# Altium schematic sheet Power.SchDoc
size A
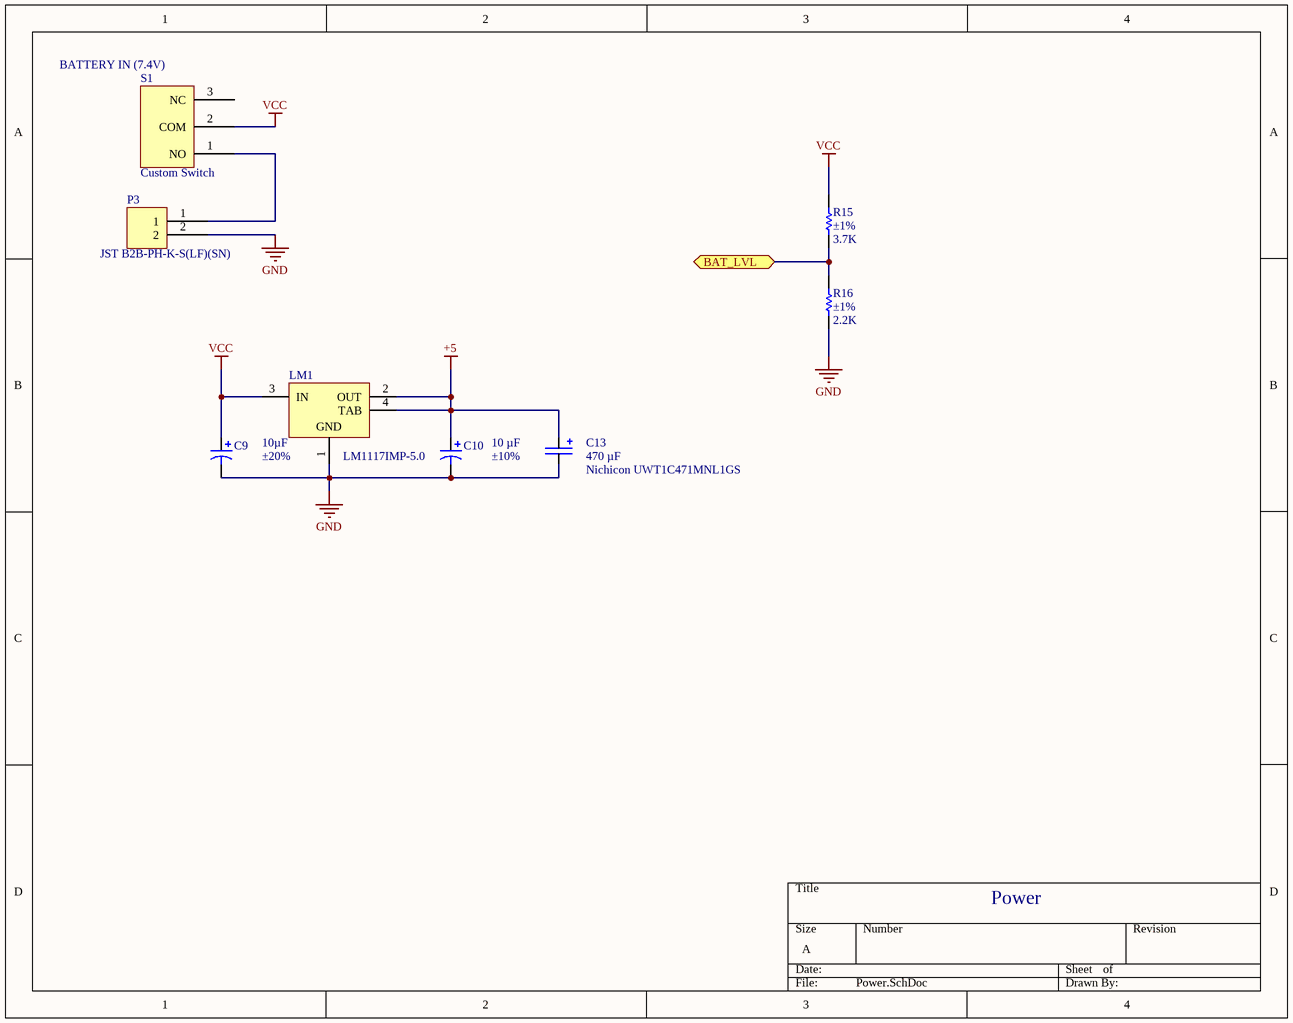
[diagram p0: Power.SchDoc]

## Parts
C9  Capacitance: 10µF  Capacitance Tolerance: ±20%  [PCB-220579-1]  (hidden comment: Kemet T491A106M006AT)
C10  Capacitance: 10 µF  Capacitance Tolerance: ±10%  [CASE B]  (hidden comment: Kemet T491B476K010AT)
C13  Nichicon UWT1C471MNL1GS  Capacitance: 470 µF  [PCB-ohlypd69c1s53jj2mkj6-1]
LM1  LM1117IMP-5.0  [MP04A_L]
P3  JST B2B-PH-K-S(LF)(SN)  [PCB-gpdi66yn1jko56crxrq7-1]
R15  Resistance Tolerance: ±1%  Resistance: 3.7K  [PCB-4097432-1]  (hidden comment: Bourns CR0805-FX-4701GLF)
R16  Resistance Tolerance: ±1%  Resistance: 2.2K  [PCB-4097432-1]  (hidden comment: Bourns CR0805-FX-4701GLF)
S1  Custom Switch  [PCB-tnt45azynpcpxvd4cmrw-1]

## Ports
BAT_LVL (bidir)

## Nets
+5: C10.1 C13.P(+) LM1.2(OUT) LM1.4(TAB)
GND: C9.2 C10.2 C13.M(-) LM1.1(GND) P3.2 R16.1
VCC: C9.1 LM1.3(IN) R15.2 S1.2(COM)
BAT_LVL: R15.1 R16.2 ; port BAT_LVL
NetP3_1: P3.1 S1.1(NO)

Not connected (* = marked no-connect by the designer): S1 3(NC)

## Notes on the sheet
- (near S1) BATTERY IN (7.4V)
- Power

## Library data of the parts
C9 = CMP-220579-2: CAP TANT 10UF 6.3V 20% 1206; Case/Package (SI): 3216-18; Equivalent Series Resistance (ESR): 4.0 Ω; Lead-Free Status: Lead Free; Voltage Rating (DC): 6.0 V; Case/Package: 3216-18; Mounting Style: Surface Mount; Number of Pins: 2; Octopart Url: https://octopart.com/t491a106m006at-kemet-219770; OctopartID: 6a85a38c1599b542; Packaging: Cut Tape (CT); REACH SVHC Compliance: No SVHC; RoHS: Compliant; Size-Height: 0.0016 m; Size-Length: 0.0032 m; Size-Width: 0.0016 m
C10 = CMP-14388383-6: Cap Tant Solid 47uF 10V B CASE 10% (3.5 X 2.8 X 1.9mm) SMD 3528-21 1 Ohm 125C Automotive T/R; Dielectric Material: Tantalum; Voltage Rating (DC): 10.0 V; Lead-Free Status: Lead Free; Equivalent Series Resistance (ESR): 1.00 Ω; Case/Package (SI): 3528-21; REACH SVHC Compliance: No SVHC; Size-Height: 1.90 mm; Size-Width: 2.80 mm; RoHS: Compliant; OctopartID: e2462b4200883d81; Packaging: Tape & Reel (TR), Cut Tape (CT); Mounting Style: Surface Mount; Case/Package: 3528-21; Manufacturer Part Number: T491B476K010AT; Octopart URL: http://octopart.com/t491b476k010at-kemet-968616; Number of Pins: 2; Size-Length: 3.50 mm
C13 = CMP-f01f3916cccd2fd8-3: 8mm x 10mm 105deg Rohs=Yes 470uf 16-Volt Surface Mtg/Pkg Aluminum Electrolytic Cap; Capacitance Tolerance: ±20%; Voltage Rating (DC): 16.0 V; Lead-Free Status: Lead Free; Octopart URL: http://octopart.com/uwt1c471mnl1gs-nichicon-203188; Dielectric Material: Aluminum Electrolytic; Size-Height: 10.0 mm; REACH SVHC Compliance: No SVHC; Packaging: Cut Tape (CT), Tape & Reel (TR); Size-Diameter: 8.00 mm; Mounting Style: Surface Mount; Manufacturer Part Number: UWT1C471MNL1GS; OctopartID: f01f3916cccd2fd8; Size-Length: 10.0 mm; RoHS: Compliant; Number of Pins: 2
LM1 = LM1117IMP-5.0/NOPB: 800mA Low-Dropout Linear Regulator, 4-pin SOT-223, Pb-Free; Current Rating: 800.0 A; Dropout Voltage: 1.2 V; Lead-Free Status: Lead Free; Number of Regulated Outputs: 1; Output Capacitor Type: Tantalum; Output Current: 0.8 A; Output Voltage: 5.0 V; Quiescent Current: 0.005 A; Supply Voltage (DC): 15.0 V; Case/Package: SOT-223; Lifecycle Status: Active; Mounting Style: Surface Mount; Number of Pins: 4; Octopart Url: https://octopart.com/lm1117imp-5.0%2Fnopb-texas+instruments-22615740; OctopartID: fae932bac933252e; REACH SVHC Compliance: No SVHC; RoHS: Compliant
P3 = CMP-642947-5: PH Series 2 Position 2 mm Pitch Through Hole Top Entry Shrouded Header; Number of Positions: 2; Pin Pitch: 2.00 mm; Current Rating: 2.00 A; Insulation Resistance: 1.00 MΩ; Gender: Male; Lead-Free Status: Lead Free; Voltage Rating (AC): 100 V; Contact Resistance: 10.0 mΩ; Packaging: Bulk; RoHS: Compliant; REACH SVHC Compliance: No SVHC; Size-Length: 5.90 mm; OctopartID: a21c6b154b5e7ddb; Octopart URL: http://octopart.com/b2b-ph-k-s%28lf%29%28sn%29-jst-248868; Size-Height: 6.00 mm; Housing Material: Nylon; Size-Width: 4.50 mm; Mounting Style: Through Hole, Vertical; Manufacturer Part Number: B2B-PH-K-S(LF)(SN); Number of Rows: 1; Contact Material: Brass; Housing Color: Natural; Number of Contacts: 2; Contact Plating: Tin
R15 R16 = CMP-97505e06006c4897-1: Res Thick Film 0805 4.7K Ohm 1% 1/8W ±100ppm/°C Molded SMD SMD Paper Tape on Plastic Reel; Voltage Rating (DC): 150 V; Power Rating: 125 mW; Manufacturer Part Number: CR0805-FX-4701GLF; REACH SVHC Compliance: No SVHC; OctopartID: 97505e06006c4897; Packaging: Tape & Reel (TR), Cut Tape (CT); Octopart URL: http://octopart.com/cr0805-fx-4701glf-bourns-6074970; Number of Pins: 2; Mounting Style: Surface Mount; RoHS: Compliant; Size-Thickness: 508 µm; Size-Length: 2.01 mm; Case/Package: 0805; Size-Width: 1.24 mm
S1 = Custom Switch-2: Switch Used in 2015's very small size robot; CustomComponentID: s1vauaimn8qz55onjbfq